# EasyEDA Pro project ProPrj_Another Person's ESP32 FRC DevKit Lite_2025-10-14.epro, board PCB3
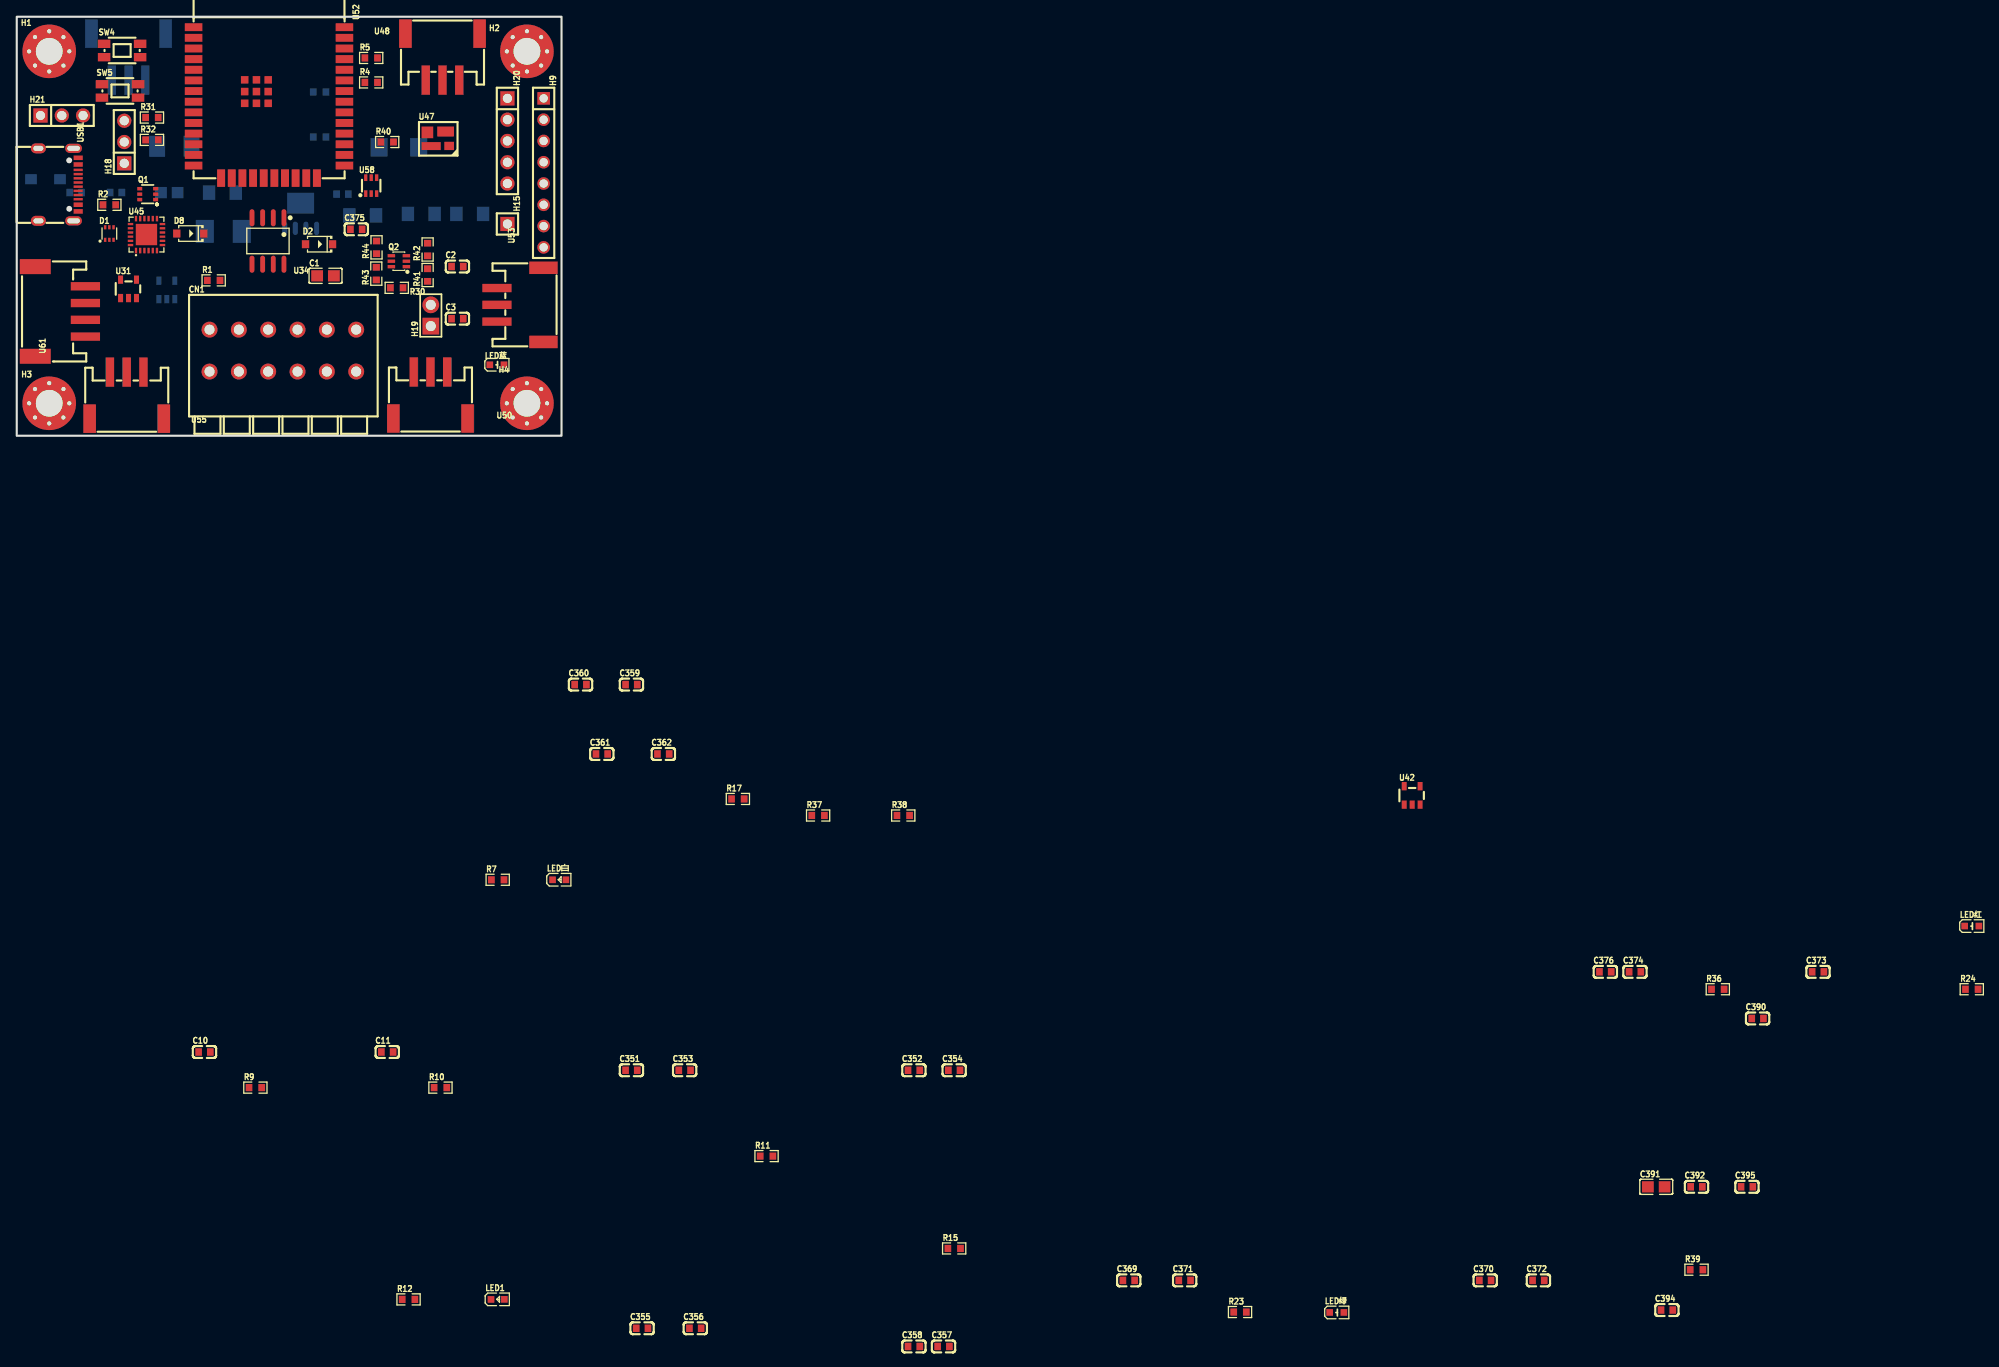
[diagram p7: board, top side]
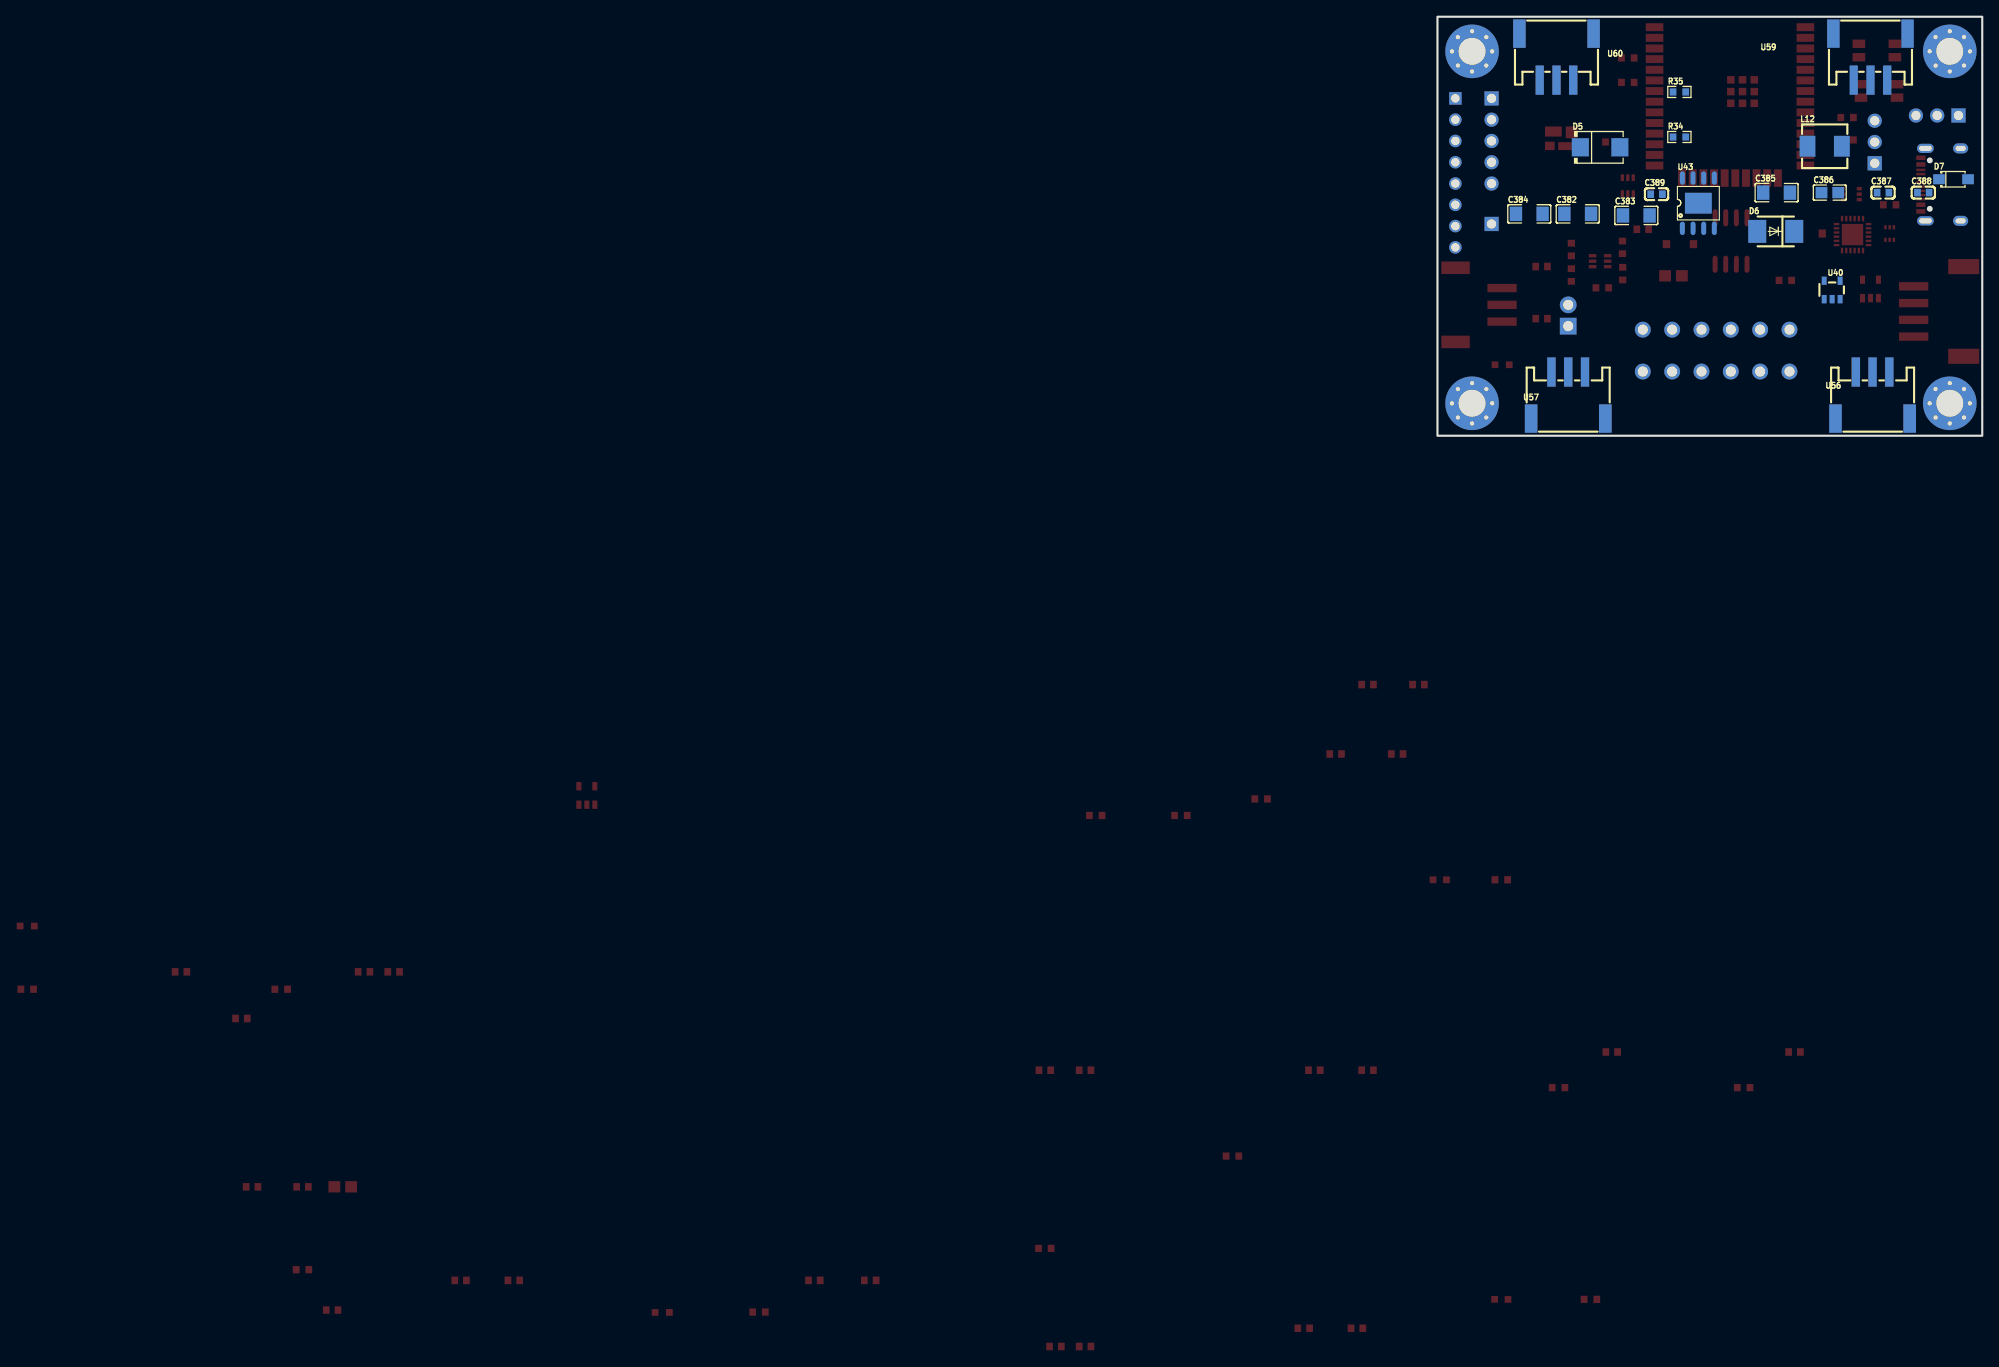
[diagram p8: board, bottom side, seen from below]

Outline 65 x 50 mm; copper layers: Top Layer, Bottom Layer. Coordinates in mm from the lower left corner of the outline.
Outline path: rectangle 0,50 65,0
Stack: Top Layer 0.035mm / Dielectric1 1.51mm FR4 er 4.5 / Bottom Layer 0.035mm

## Design rules (mm)
template: JLCPCB Capability(Two Layers Board)
spacing copperThickness1oz (default): track to track 0.102, other pairs 0.152 to 0.3
spacing copperThickness2oz: track to track 0.203, other pairs 0.152 to 0.3
track width copperThickness1oz (default): min 0.127, default 0.254, max 2.54
track width copperThickness2oz: min 0.203, default 0.254, max 2.54
differential pair differentialPair (default): width min 0.127, default 0.254, max 2.54; gap min 0.152, default 0.152
via viaSize (default): diameter min 0.5, default 0.61, max 10; hole min 0.3, default 0.305, max 6.3

## Placement (name value [footprint] x y rotation side)
C1  22uF  [C0805]  36.84 19.08 0 top
C2  10uF  [C0603]  52.58 20.19 0 top
C3  100nF  [C0603]  52.58 13.97 0 top
C10  100nF  [C0603]  22.4 -73.54 0 top
C11  100nF  [C0603]  44.21 -73.54 0 top
C351  10uF  [C0603]  73.34 -75.72 0 top
C352  10uF  [C0603]  107.05 -75.72 0 top
C353  100nF  [C0603]  79.69 -75.72 0 top
C354  100nF  [C0603]  111.85 -75.72 0 top
C355  10uF  [C0603]  74.61 -106.51 0 top
C356  100nF  [C0603]  80.96 -106.51 0 top
C357  10uF  [C0603]  110.58 -108.69 0 top
C358  100nF  [C0603]  107.05 -108.69 0 top
C359  100nF  [C0603]  73.34 -29.7 0 top
C360  4.7uF  [C0603]  67.27 -29.7 0 top
C361  10uF  [C0603]  69.81 -37.98 0 top
C362  100nF  [C0603]  77.15 -37.98 0 top
C369  10uF  [C0603]  132.68 -100.8 0 top
C370  10uF  [C0603]  175.21 -100.8 0 top
C371  100nF  [C0603]  139.35 -100.8 0 top
C372  100nF  [C0603]  181.56 -100.8 0 top
C373  10uF  [C0603]  214.92 -63.98 0 top
C374  100nF  [C0603]  193.08 -63.98 0 top
C375  100nF  [C0603]  40.51 24.64 0 top
C376  10uF  [C0603]  189.55 -63.98 0 top
C382  10uF  [C1206]  48.27 26.47 180 bottom
C383  22uF  [C1206]  41.27 26.29 180 bottom
C384  100nF  [C1206]  54.05 26.47 180 bottom
C385  47uF  [C1206]  24.54 29.01 180 bottom
C386  22uF  [C0805]  18.19 29.01 180 bottom
C387  10uF  [C0603]  11.84 29.01 180 bottom
C388  100nF  [C0603]  7.03 29.01 180 bottom
C389  100nF  [C0603]  38.86 28.83 180 bottom
C390  4.7uF  [C0603]  207.71 -69.54 0 top
C391  22uF  [C0805]  195.62 -89.63 0 top
C392  10uF  [C0603]  200.42 -89.63 0 top
C394  100nF  [C0603]  196.89 -104.34 0 top
C395  100nF  [C0603]  206.44 -89.63 0 top
CN1  New_Library_2601-1106  [CONN-TH_2601-1106]  31.75 10.16 0 top
D1  USBLC6-2P6  [SOT-666-6_L1.6-W1.2-P0.50-LS1.6-BL]  11.05 24.13 0 top
D2  5819W  [SOD-123_L2.7-W1.6-LS3.7-FD]  36.07 22.86 0 top
D5  SS54SMB  [SMB_L4.6-W3.6-LS5.3-RD]  45.59 34.42 180 bottom
D6  SMBJ28A  [SMB_L4.6-W3.6-LS5.3-L-FD]  24.64 24.38 180 bottom
D7  DSK34  [SOD-123FL_L2.7-W1.8-LS3.8-RD]  3.43 30.61 180 bottom
D8  5819W  [SOD-123_L2.7-W1.6-LS3.7-FD]  20.7 24.13 0 top
H1  Hole_Pad  [MountingHole:MountingHole_3.2mm_M3_Pad_Via]  3.87 45.87 0 top
H2  Hole_Pad  [MountingHole:MountingHole_3.2mm_M3_Pad_Via]  60.87 45.87 0 top
H3  Hole_Pad  [MountingHole:MountingHole_3.2mm_M3_Pad_Via]  3.87 3.87 0 top
H4  Hole_Pad  [MountingHole:MountingHole_3.2mm_M3_Pad_Via]  60.87 3.87 0 top
H9  PZ254V-11-08P  [HDR-TH_8P-P2.54-V-M]  62.86 31.37 270 top
H15  PZ254V-11-01P  [HDR-TH_1P-P2.54-V-M]  58.55 25.27 270 top
H18  PZ254V-11-03P  [HDR-TH_3P-P2.54-V-M]  12.83 35.05 90 top
H19  PZ254V-11-02P  [HDR-TH_2P-P2.54-V-M]  49.4 14.35 90 top
H20  PZ254V-11-05P  [HDR-TH_5P-P2.54-V-M]  58.55 35.18 270 top
H21  PZ254V-11-03P  [HDR-TH_3P-P2.54-V-M]  5.37 38.22 0 top
L12  10uH  [IND-SMD_L5.4-W5.2_FXL0530]  18.8 34.54 180 bottom
LED1  XL-1608VRC-06  [LED0603-RD_PINK]  57.38 -103.07 0 top
LED白  NCD0603W1  [LED0603-RD]  64.73 -52.99 0 top
LED红  SZYY0603R  [LED0603-R-RD]  233.27 -58.51 0 top
LED绿  XL-1608PGC-06  [LED0603-RD_GREEN]  157.56 -104.58 0 top
LED蓝  SZYY0603B  [LED0603-R-RD_BLUE]  57.28 8.51 0 top
Q1  UMH3N  [SC-70-6_L2.2-W1.3-P0.65-LS2.1-BR]  15.62 28.83 0 top
Q2  BSS138BKS,115  [SOT-363_L2.0-W1.3-P0.65-LS2.1-BR]  45.59 20.83 0 top
R1  5.1kΩ  [R0603]  23.5 18.54 0 top
R2  5.1kΩ  [R0603]  11.05 27.56 0 top
R4  22Ω  [R0603]  42.29 42.16 0 top
R5  22Ω  [R0603]  42.29 45.08 0 top
R7  10kΩ  [R0603]  57.38 -52.99 0 top
R9  10kΩ  [R0603]  28.47 -77.79 0 top
R10  10kΩ  [R0603]  50.56 -77.79 0 top
R11  10kΩ  [R0603]  89.46 -85.97 0 top
R12  1kΩ  [R0603]  46.75 -103.07 0 top
R15  0Ω  [R0603]  111.85 -96.99 0 top
R17  4.7kΩ  [R0603]  86.04 -43.34 0 top
R23  10kΩ  [R0603]  145.96 -104.58 0 top
R24  10kΩ  [R0603]  233.27 -66.05 0 top
R30  120Ω  [R0603]  45.34 17.65 180 top
R31  82kΩ  [R0603]  16.13 37.97 0 top
R32  10kΩ  [R0603]  16.13 35.31 0 top
R34  10kΩ  [R0603]  36.14 35.65 180 bottom
R35  31.3kΩ  [R0603]  36.14 41.03 180 bottom
R36  470kΩ  [R0603]  202.96 -66.05 0 top
R37  22.1  [R0603]  95.62 -45.32 0 top
R38  47.5K  [R0603]  105.78 -45.32 0 top
R39  10kΩ  [R0603]  200.42 -99.53 0 top
R40  500  [R0603]  44.2 35.05 0 top
R41  10kΩ  [R0603]  49.02 19.18 90 top
R42  10kΩ  [R0603]  49.02 22.22 90 top
R43  10kΩ  [R0603]  42.9 19.35 90 top
R44  10kΩ  [R0603]  42.93 22.48 90 top
SW4  KMR241GLFS  [KEY-SMD_4P-L4.2-W2.8-P1.60-LS4.6]  12.57 45.97 0 top
SW5  KMR241GLFS  [KEY-SMD_4P-L4.2-W2.8-P1.60-LS4.6]  12.32 41.15 0 top
U31  ME6211C30M5G-N  [SOT-23-5_L2.9-W1.6-P0.95-LS2.8-BL]  13.33 17.53 0 top
U34  TJA1051T/3/1J  [SOIC-8_L4.9-W3.9-P1.27-LS6.0-BL]  29.97 23.24 180 top
U40  ME6211C30M5G-N  [SOT-23-5_L2.9-W1.6-P0.95-LS2.8-BL]  17.91 17.4 180 bottom
U42  ME6211C30M5G-N  [SOT-23-5_L2.9-W1.6-P0.95-LS2.8-BL]  166.5 -42.93 0 top
U43  TPS5450MDDAREP  [POWERPAD-SO-8_L4.9-W3.9-P1.27-LS6.0-BL-EP]  33.87 27.75 180 bottom
U45  CP2102N-A01-GQFN24  [QFN-24_L4.0-W4.0-P0.50-BL-EP2.6]  15.48 24.01 0 top
U47  SK6812MINI-C  [LED-SMD_4P-L3.5-W3.5-R-SK6812MINI]  50.29 35.43 0 top
U48  S3B-PH-SM4-TB(LF)(SN)  [CONN-SMD_S3B-PH-SM4-TB-LF-SN]  50.8 45.21 0 top
U50  S3B-PH-SM4-TB(LF)(SN)  [CONN-SMD_S3B-PH-SM4-TB-LF-SN]  49.36 4.84 180 top
U52  ESP32-WROOM-32E-H4  [WIFI-SMD_ESP32-WROOM-32E]  30.1 39.75 270 top
U53  S3B-PH-SM4-TB(LF)(SN)  [CONN-SMD_S3B-PH-SM4-TB-LF-SN]  60.07 15.62 270 top
U55  S3B-PH-SM4-TB(LF)(SN)  [CONN-SMD_S3B-PH-SM4-TB-LF-SN]  13.12 4.81 180 top
U56  S3B-PH-SM4-TB(LF)(SN)  [CONN-SMD_S3B-PH-SM4-TB-LF-SN]  13.08 4.83 0 bottom
U57  S3B-PH-SM4-TB(LF)(SN)  [CONN-SMD_S3B-PH-SM4-TB-LF-SN]  49.4 4.83 0 bottom
U58  74HCT2G34GW,125  [SC-88-6_L2.0-W1.3-P0.65-LS2.1-BL]  42.29 29.84 0 top
U59  S3B-PH-SM4-TB(LF)(SN)  [CONN-SMD_S3B-PH-SM4-TB-LF-SN]  13.33 45.21 180 bottom
U60  S3B-PH-SM4-TB(LF)(SN)  [CONN-SMD_S3B-PH-SM4-TB-LF-SN]  50.8 45.21 180 bottom
U61  S4B-PH-SM4-TB(LF)(SN)  [CONN-SMD_S4B-PH-SM4-TB-LF-SN]  5.2 14.83 90 top
USB1  TYPE-C 16PIN 2MD(073)  [USB-C-SMD_TYPE-C-6PIN-2MD-073]  4.95 29.97 270 top

## Footprints (pads in the part's own frame, mm; a bottom-side part is the same pattern mirrored in y, then rotated)
C0603
  rect 0.8x0.9 smd: 1(-0.7,0) 2(0.7,0)
C0805
  rect 1.41x1.35 smd: 1(-1,0) 2(1,0)
C1206
  rect 1.485x1.728 smd: 1(-1.593,0) 2(1.593,0)
CONN-SMD_S3B-PH-SM4-TB-LF-SN
  rect 1.5x3.4 smd: 0(-4.425,2.775) 0(4.425,2.775)
  rect 1x3.5 smd: 1(2,-2.775) 2(0,-2.775) 3(-2,-2.775)
CONN-SMD_S4B-PH-SM4-TB-LF-SN
  rect 1x3.5 smd: 1(3,-2.987) 2(1,-2.987) 3(-1,-2.987) 4(-3,-2.987)
  rect 1.8x3.7 smd: 5(-5.35,2.987) 6(5.35,2.987)
CONN-TH_2601-1106
  round 1.9 hole 1.2: 1(-8.75,2.5) 1(-8.75,-2.5) 2(-5.25,2.5) 2(-5.25,-2.5) 3(-1.75,2.5) 3(-1.75,-2.5) 4(1.75,2.5) 4(1.75,-2.5) 5(5.25,2.5) 5(5.25,-2.5) 6(8.75,2.5) 6(8.75,-2.5)
HDR-TH_1P-P2.54-V-M
  rect 1.7x1.7 hole 1.1: 1(0,0)
HDR-TH_2P-P2.54-V-M
  rect 2x2 hole 1.2: 1(-1.27,0)
  round 2 hole 1.2: 2(1.27,0)
HDR-TH_3P-P2.54-V-M
  rect 1.7x1.7 hole 1.1: 1(-2.54,0)
  round 1.7 hole 1.1: 2(0,0) 3(2.54,0)
HDR-TH_5P-P2.54-V-M
  rect 1.7x1.7 hole 1.1: 1(-5.08,0)
  round 1.7 hole 1.1: 2(-2.54,0) 3(0,0) 4(2.54,0) 5(5.08,0)
HDR-TH_8P-P2.54-V-M
  rect 1.5x1.5 hole 1: 1(-8.89,0)
  round 1.5 hole 1: 2(-6.35,0) 3(-3.81,0) 4(-1.27,0) 5(1.27,0) 6(3.81,0) 7(6.35,0) 8(8.89,0)
IND-SMD_L5.4-W5.2_FXL0530
  rect 1.9x2.5 smd: 1(-2.05,0) 2(2.05,0)
KEY-SMD_4P-L4.2-W2.8-P1.60-LS4.6
  rect 1.5x1 smd: 1(-2.15,0.8) 2(2.15,0.8) 3(-2.15,-0.8) 4(2.15,-0.8)
LED0603-R-RD
  rect 0.8x0.8 smd: 1(0.851,0) 2(-0.851,0)
LED0603-R-RD_BLUE
  rect 0.8x0.8 smd: 1(0.862,-0.038) 2(-0.841,-0.038)
LED0603-RD
  rect 0.8x0.8 smd: 1(-0.799,0) 2(0.799,0)
LED0603-RD_GREEN
  rect 0.8x0.8 smd: 1(0.791,-0.05) 2(-0.911,-0.05)
LED0603-RD_PINK
  rect 0.8x0.8 smd: 1(-0.799,-0.004) 2(0.799,0.004)
LED-SMD_4P-L3.5-W3.5-R-SK6812MINI
  rect 1.15x1 smd: 1(1.3,-0.845)
  rect 2x1.2 smd: 2(0.875,0.87)
  rect 1.4x1.4 smd: 3(-1.3,0.77)
  rect 2.3x0.95 smd: 4(-0.85,-0.87)
MountingHole:MountingHole_3.2mm_M3_Pad_Via
  round 0.8 hole 0.5: 1(-2.4,0) 1(-1.697,1.697) 1(-1.697,-1.697) 1(0,2.4) 1(0,-2.4) 1(1.697,1.697) 1(1.697,-1.697) 1(2.4,0)
  round 6.4 hole 3.2: 1(0,0)
POWERPAD-SO-8_L4.9-W3.9-P1.27-LS6.0-BL-EP
  oval 0.6x1.6 smd: 1(-1.905,-3) 2(-0.635,-3) 3(0.635,-3) 4(1.905,-3) 5(1.905,3) 6(0.635,3) 7(-0.635,3) 8(-1.905,3)
  rect 3.2x2.5 smd: 9(0,0)
QFN-24_L4.0-W4.0-P0.50-BL-EP2.6
  rect 0.28x0.665 smd: 1(-1.25,-1.907) 2(-0.75,-1.907) 3(-0.25,-1.907) 4(0.25,-1.907) 5(0.75,-1.907) 6(1.25,-1.907) 13(1.25,1.907) 14(0.75,1.907) 15(0.25,1.907) 16(-0.25,1.907) 17(-0.75,1.907) 18(-1.25,1.907)
  rect 0.665x0.28 smd: 7(1.907,-1.25) 8(1.907,-0.75) 9(1.907,-0.25) 10(1.907,0.25) 11(1.907,0.75) 12(1.907,1.25) 19(-1.907,1.25) 20(-1.907,0.75) 21(-1.907,0.25) 22(-1.907,-0.25) 23(-1.907,-0.75) 24(-1.907,-1.25)
  rect 2.55x2.55 smd: 25(0,0)
R0603
  rect 0.806x0.864 smd: 1(-0.753,0) 2(0.753,0)
SC-70-6_L2.2-W1.3-P0.65-LS2.1-BR
  rect 0.6x0.42 smd: 1(0.95,-0.65) 2(0.95,0) 3(0.95,0.65) 4(-0.95,0.65) 5(-0.95,0) 6(-0.95,-0.65)
SC-88-6_L2.0-W1.3-P0.65-LS2.1-BL
  rect 0.4x0.8 smd: 1(-0.65,-0.95) 2(0,-0.95) 3(0.65,-0.95) 4(0.65,0.95) 5(0,0.95) 6(-0.65,0.95)
SMB_L4.6-W3.6-LS5.3-L-FD
  rect 2.159x2.743 smd: 1(-2.21,0) 2(2.21,0)
SMB_L4.6-W3.6-LS5.3-RD
  rect 2.047x2.192 smd: 1(-2.361,0) 2(2.361,0)
SOD-123_L2.7-W1.6-LS3.7-FD
  rect 0.88x0.96 smd: 1(-1.61,0) 2(1.61,0)
SOD-123FL_L2.7-W1.8-LS3.8-RD
  rect 1.4x1.2 smd: 1(-1.735,0) 2(1.735,0)
SOIC-8_L4.9-W3.9-P1.27-LS6.0-BL
  oval 0.588x2.045 smd: 1(-1.905,-2.772) 2(-0.635,-2.772) 3(0.635,-2.772) 4(1.905,-2.772) 5(1.905,2.772) 6(0.635,2.772) 7(-0.635,2.772) 8(-1.905,2.772)
SOT-23-5_L2.9-W1.6-P0.95-LS2.8-BL
  rect 0.6x1 smd: 1(-0.95,-1.1) 2(0,-1.1) 3(0.95,-1.1) 4(0.95,1.1) 5(-0.95,1.1)
SOT-363_L2.0-W1.3-P0.65-LS2.1-BR
  rect 0.9x0.4 smd: 1(0.9,-0.65) 2(0.9,0) 3(0.9,0.65) 4(-0.9,0.65) 5(-0.9,0) 6(-0.9,-0.65)
SOT-666-6_L1.6-W1.2-P0.50-LS1.6-BL
  rect 0.3x0.5 smd: 1(-0.5,-0.75) 2(0,-0.75) 3(0.5,-0.75) 4(0.5,0.75) 5(0,0.75) 6(-0.5,0.75)
USB-C-SMD_TYPE-C-6PIN-2MD-073
  rect 0.55x1.1 smd: 1(-3.2,2.375) 2(-2.4,2.375) 11(2.4,2.375) 12(3.2,2.375)
  rect 0.3x1.1 smd: 3(-1.75,2.375) 4(-1.25,2.375) 5(-0.75,2.375) 6(-0.25,2.375) 7(0.25,2.375) 8(0.75,2.375) 9(1.25,2.375) 10(1.75,2.375)
  oval 1.1x2 hole 0.6x1.5: 13(-4.325,1.825) 14(4.325,1.825)
  oval 1.2x1.8 hole 0.6x1.2: 13(-4.325,-2.375) 14(4.325,-2.375)
WIFI-SMD_ESP32-WROOM-32E
  rect 0.95x2.1 smd: 1(-9.002,-9) 2(-7.732,-9) 3(-6.463,-9) 4(-5.192,-9) 5(-3.922,-9) 6(-2.652,-9) 7(-1.383,-9) 8(-0.113,-9) 9(1.157,-9) 10(2.428,-9) 11(3.697,-9) 12(4.968,-9) 13(6.237,-9) 14(7.508,-9) 25(7.508,9) 26(6.237,9) 27(4.968,9) 28(3.697,9) 29(2.428,9) 30(1.157,9) 31(-0.113,9) 32(-1.383,9) 33(-2.652,9) 34(-3.922,9) 35(-5.192,9) 36(-6.463,9) 37(-7.732,9) 38(-9.002,9)
  rect 2.1x0.95 smd: 15(9.002,-5.715) 16(9.002,-4.445) 17(9.002,-3.175) 18(9.002,-1.905) 19(9.002,-0.635) 20(9.002,0.635) 21(9.002,1.905) 22(9.002,3.175) 23(9.002,4.445) 24(9.002,5.715)
  rect 0.9x0.9 smd: 39(-2.721,-0.1) 39(-2.721,-1.5) 39(-2.721,-2.9) 39(-1.321,-0.1) 39(-1.321,-1.5) 39(-1.321,-2.9) 39(0.079,-0.1) 39(0.079,-1.5) 39(0.079,-2.9)

## Nets
As in the schematic.

Pads without a net: C359 1; H1 1; H2 1; H3 1; H4 1; H9 4; SW4 1 3; SW5 1 3; U31 4; U40 4; U42 4; U43 2 3 5; U45 1 10 11 12 13 14 15 16 17 18 22 24 25; U48 0; U50 0; U52 17 18 19 20 21 22 32; U53 0; U55 0; U56 0; U57 0; U58 3 4; U59 0; U60 0; U61 5 6; USB1 3 9
